# EAGLE board v2 (EAGLE 9.6.2), part 1 of 2
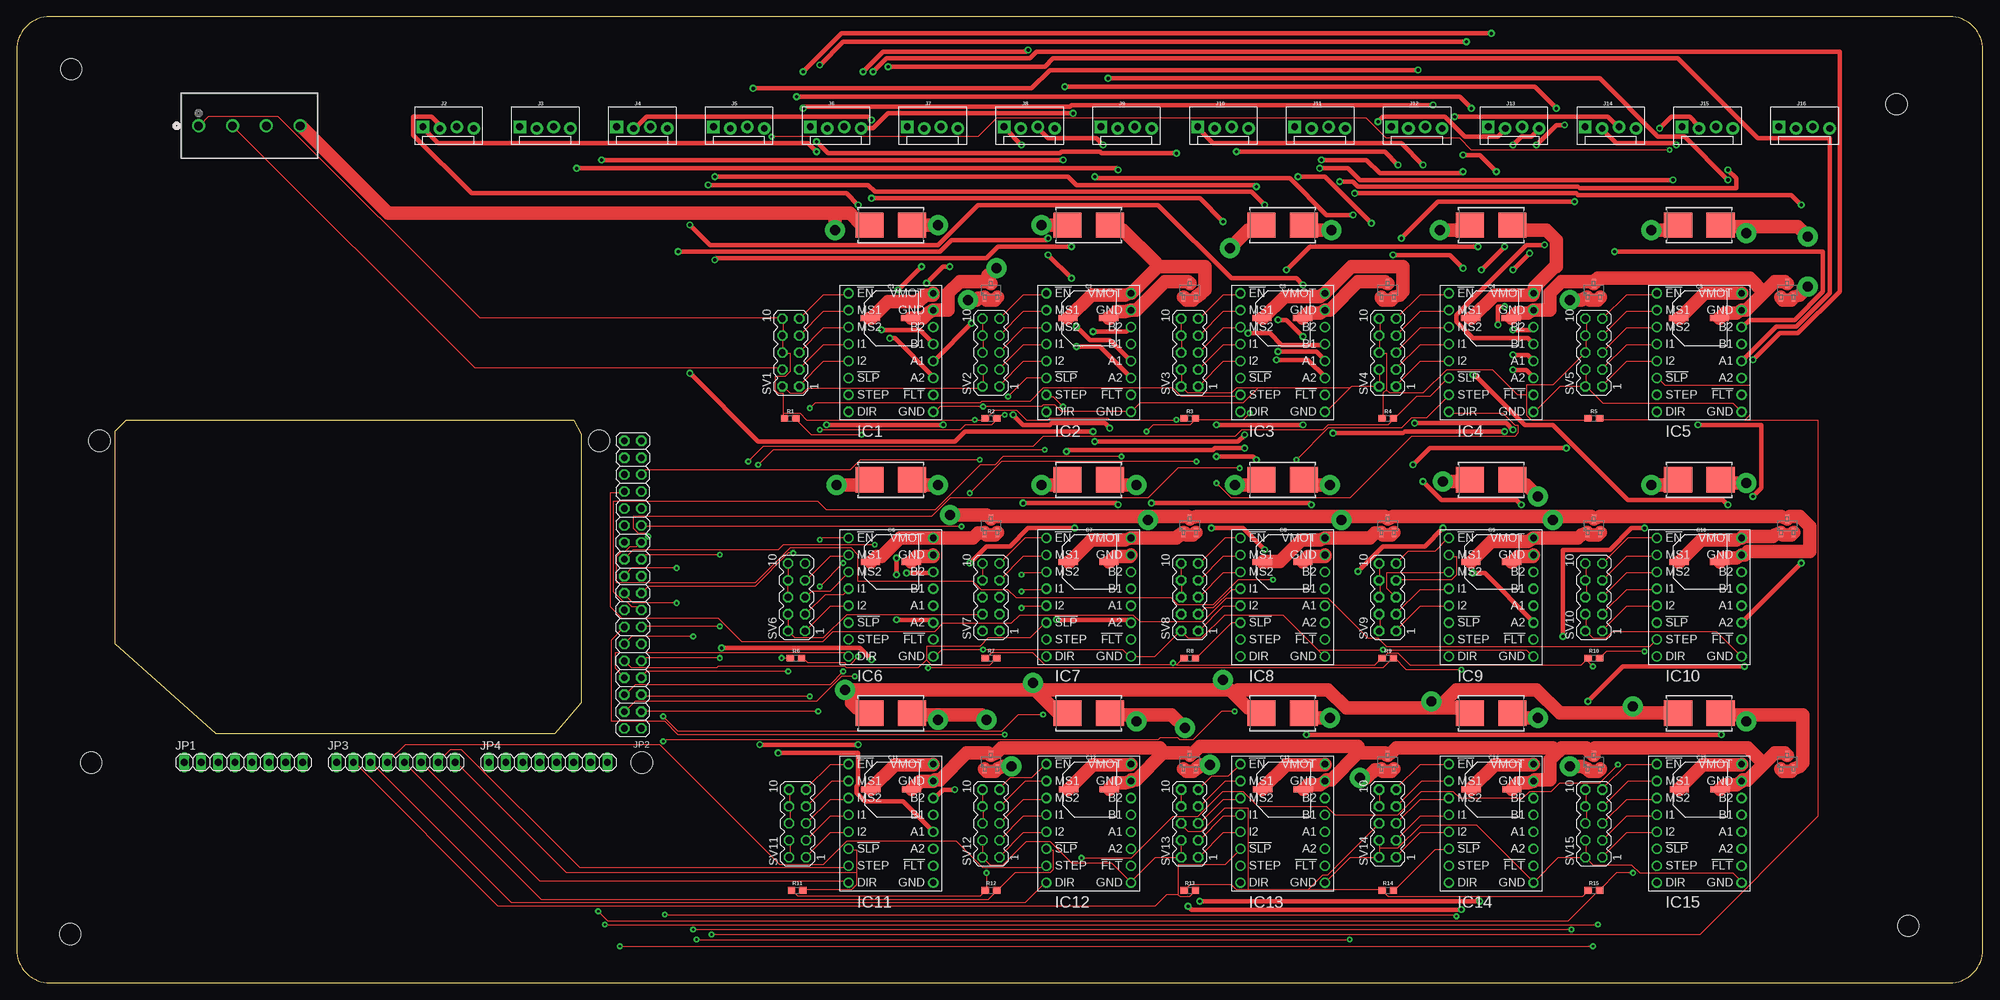
[diagram p5: board, top side]
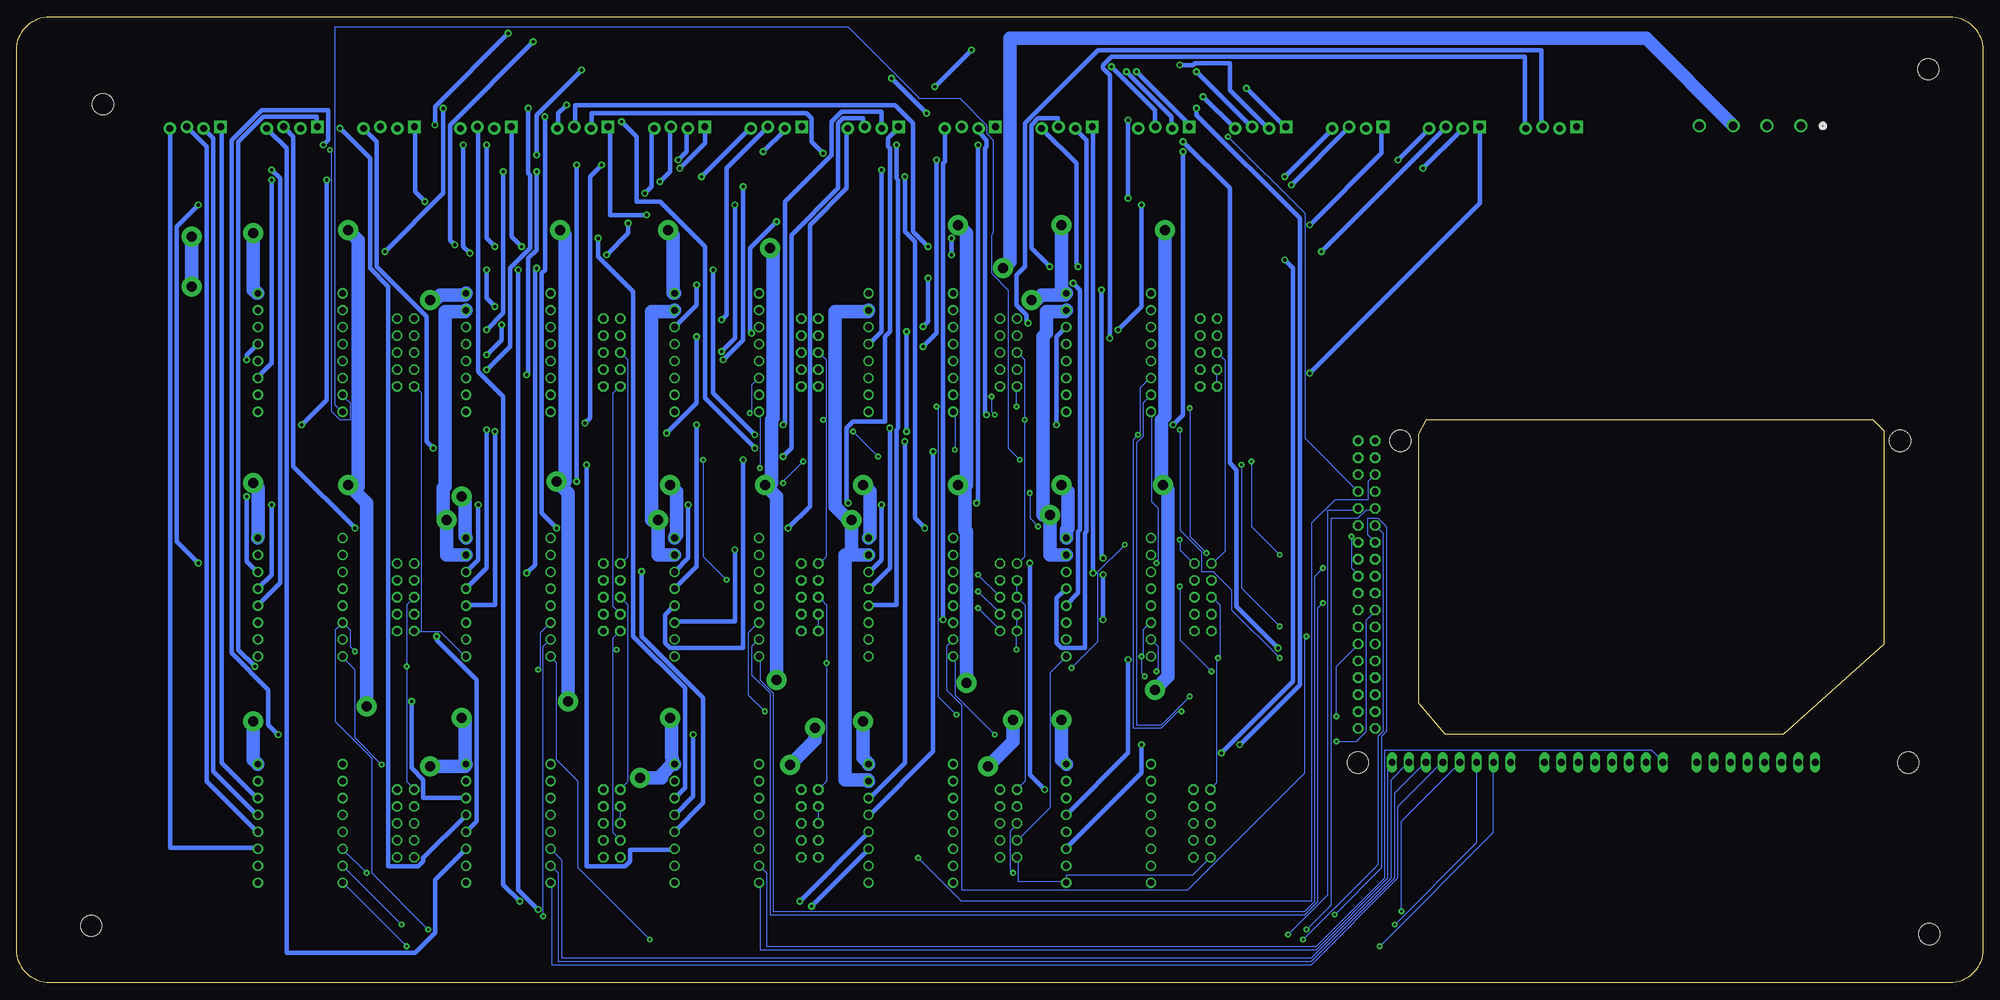
[diagram p6: board, bottom side, seen from below]

Size 295 x 145 mm. Coordinates in mm from the lower left corner, seen from the top.
Outline: 0,140 0,5 arc90 5,0 290,0 arc90 295,5 295,140 arc90 290,145 5,145 arc90 0,140
Outline: 14.8,82.8 16.45,84.45 83.55,84.45 84.7,82.4 84.7,42.05 80.7,37.4 29.9,37.4 14.8,50.9 14.8,82.8
Copper layers (1*16): Top 0.035mm / dielectric 1.5mm / Bottom 0.035mm
Design rules "default *": minimum track width 6mil, minimum drill 0.35mm, track to track 6mil, track to pad 6mil, pad to pad 6mil, via to via 6mil, smd to smd 6mil, copper to edge 40mil, drill to drill 6mil, minimum pad ring 10mil, minimum via ring 10mil, stop-mask expansion 4mil, vias tented up to drill 0mil, thermal gap 10mil
Net classes: 1 Motor: width 0.699 mm, drill 0.5 mm; 2 VMOT: width 0.699 mm, drill 0.5 mm; 3 GND: width 0.699 mm, drill 0.5 mm; 4 PreFuse: width 2.032 mm, drill 1.5 mm, clearance 0.006 mm
Holes 3.2 mm at 8.05,7.32 12.43,81.35 11.16,33.05 87.39,81.35 93.79,33.05 8.2,137.12 283.8,8.57 282.05,131.87

## Footprints (pad centres in the part's own frame; a part is rotated, then mirrored left to right if it is on the bottom)
8X10.5 = smd 2.9 x 0.9: + -3.05,0; - 3.05,0
SOT-23_DBZ_TEX = smd 0.568 x 1.31: 1 -0.95,-1.016; 2 0.95,-1.016; 3 0,1.016
0154SERIES_LTF = smd 4.242 x 3.81: 1 -3.188,0; 2 3.188,0
MP6500 = drill 1.016: 1 -6.35,8.89; 2 -6.35,6.35; 3 -6.35,3.81; 4 -6.35,1.27; 5 -6.35,-1.27; 6 -6.35,-3.81; 7 -6.35,-6.35; 8 -6.35,-8.89; 9 6.35,-8.89; 10 6.35,-6.35; 11 6.35,-3.81; 12 6.35,-1.27; 13 6.35,1.27; 14 6.35,3.81; 15 6.35,6.35; 16 6.35,8.89
CONN_1888700_PXC = drill 1.295 pad 1.803: 1 0,0; 2 5.08,0; 3 10.16,0; 4 15.24,0
MOLEX-1X4_LOCK = drill 1.016 pad 1.88 square: 1 0,0.127 | drill 1.016 pad 1.88: 2 2.54,-0.127; 3 5.08,0.127; 4 7.62,-0.127
1X08 = drill 1.016 long: 1 -8.89,0; 2 -6.35,0; 3 -3.81,0; 4 -1.27,0; 5 1.27,0; 6 3.81,0; 7 6.35,0; 8 8.89,0
2X18 = drill 1.016 octagon: 1 -21.59,-1.27; 2 -21.59,1.27; 3 -19.05,-1.27; 4 -19.05,1.27; 5 -16.51,-1.27; 6 -16.51,1.27; 7 -13.97,-1.27; 8 -13.97,1.27; 9 -11.43,-1.27; 10 -11.43,1.27; 11 -8.89,-1.27; 12 -8.89,1.27; 13 -6.35,-1.27; 14 -6.35,1.27; 15 -3.81,-1.27; 16 -3.81,1.27; 17 -1.27,-1.27; 18 -1.27,1.27; 19 1.27,-1.27; 20 1.27,1.27; 21 3.81,-1.27; 22 3.81,1.27; 23 6.35,-1.27; 24 6.35,1.27; 25 8.89,-1.27; 26 8.89,1.27; 27 11.43,-1.27; 28 11.43,1.27; 29 13.97,-1.27; 30 13.97,1.27; 31 16.51,-1.27; 32 16.51,1.27; 33 19.05,-1.27; 34 19.05,1.27; 35 21.59,-1.27; 36 21.59,1.27
0603 = smd 1.1 x 1: 1 -0.85,0; 2 0.85,0
MA05-2 = drill 1.016 octagon: 1 -5.08,-1.27; 2 -5.08,1.27; 3 -2.54,-1.27; 4 -2.54,1.27; 5 0,-1.27; 6 0,1.27; 7 2.54,-1.27; 8 2.54,1.27; 9 5.08,-1.27; 10 5.08,1.27

## Placement (x,y rotation side)
C1  100uF  [8X10.5]  131.12,99.74 0 top
C2  100uF  [8X10.5]  160.79,99.74 0 top
C3  100uF  [8X10.5]  189.89,99.74 0 top
C4  100uF  [8X10.5]  221.19,99.74 0 top
C5  100uF  [8X10.5]  252.4,99.74 0 top
C6  100uF  [8X10.5]  131.16,63.17 0 top
C7  100uF  [8X10.5]  160.84,63.17 0 top
C8  100uF  [8X10.5]  189.94,63.17 0 top
C9  100uF  [8X10.5]  221.24,63.17 0 top
C10  100uF  [8X10.5]  252.45,63.17 0 top
C11  100uF  [8X10.5]  131.22,29.02 0 top
C12  100uF  [8X10.5]  160.89,29.02 0 top
C13  100uF  [8X10.5]  189.99,29.02 0 top
C14  100uF  [8X10.5]  221.29,29.02 0 top
C15  100uF  [8X10.5]  252.5,29.02 0 top
CR1  PESD2CAN24DBZRQ1  [SOT-23_DBZ_TEX]  146.18,103.92 0 top
CR2  PESD2CAN24DBZRQ1  [SOT-23_DBZ_TEX]  176,103.92 0 top
CR3  PESD2CAN24DBZRQ1  [SOT-23_DBZ_TEX]  205.7,103.92 0 top
CR4  PESD2CAN24DBZRQ1  [SOT-23_DBZ_TEX]  236.62,103.92 0 top
CR5  PESD2CAN24DBZRQ1  [SOT-23_DBZ_TEX]  265.65,103.92 0 top
CR6  PESD2CAN24DBZRQ1  [SOT-23_DBZ_TEX]  146.18,68.6 0 top
CR7  PESD2CAN24DBZRQ1  [SOT-23_DBZ_TEX]  176,68.6 0 top
CR8  PESD2CAN24DBZRQ1  [SOT-23_DBZ_TEX]  205.7,68.6 0 top
CR9  PESD2CAN24DBZRQ1  [SOT-23_DBZ_TEX]  236.62,68.6 0 top
CR10  PESD2CAN24DBZRQ1  [SOT-23_DBZ_TEX]  265.65,68.6 0 top
CR11  PESD2CAN24DBZRQ1  [SOT-23_DBZ_TEX]  146.18,33.12 0 top
CR12  PESD2CAN24DBZRQ1  [SOT-23_DBZ_TEX]  176,33.12 0 top
CR13  PESD2CAN24DBZRQ1  [SOT-23_DBZ_TEX]  205.7,33.12 0 top
CR14  PESD2CAN24DBZRQ1  [SOT-23_DBZ_TEX]  236.62,33.12 0 top
CR15  PESD2CAN24DBZRQ1  [SOT-23_DBZ_TEX]  265.65,33.12 0 top
F1  [0154SERIES_LTF]  131.16,113.71 0 top
F2  [0154SERIES_LTF]  160.84,113.71 0 top
F3  [0154SERIES_LTF]  189.94,113.71 0 top
F4  [0154SERIES_LTF]  221.24,113.71 0 top
F5  [0154SERIES_LTF]  252.45,113.71 0 top
F6  [0154SERIES_LTF]  131.16,75.47 0 top
F7  [0154SERIES_LTF]  160.84,75.47 0 top
F8  [0154SERIES_LTF]  189.94,75.47 0 top
F9  [0154SERIES_LTF]  221.24,75.47 0 top
F10  [0154SERIES_LTF]  252.45,75.47 0 top
F11  [0154SERIES_LTF]  131.16,40.45 0 top
F12  [0154SERIES_LTF]  160.84,40.45 0 top
F13  [0154SERIES_LTF]  189.94,40.45 0 top
F14  [0154SERIES_LTF]  221.24,40.45 0 top
F15  [0154SERIES_LTF]  252.45,40.45 0 top
IC1  2969-MP6500  [MP6500]  131.16,94.59 0 top
IC2  2969-MP6500  [MP6500]  160.84,94.59 0 top
IC3  2969-MP6500  [MP6500]  189.94,94.59 0 top
IC4  2969-MP6500  [MP6500]  221.24,94.59 0 top
IC5  2969-MP6500  [MP6500]  252.45,94.59 0 top
IC6  2969-MP6500  [MP6500]  131.16,57.87 0 top
IC7  2969-MP6500  [MP6500]  160.84,57.87 0 top
IC8  2969-MP6500  [MP6500]  189.94,57.87 0 top
IC9  2969-MP6500  [MP6500]  221.24,57.87 0 top
IC10  2969-MP6500  [MP6500]  252.45,57.87 0 top
IC11  2969-MP6500  [MP6500]  131.16,23.93 0 top
IC12  2969-MP6500  [MP6500]  160.84,23.93 0 top
IC13  2969-MP6500  [MP6500]  189.94,23.93 0 top
IC14  2969-MP6500  [MP6500]  221.24,23.93 0 top
IC15  2969-MP6500  [MP6500]  252.45,23.93 0 top
J1  1888700  [CONN_1888700_PXC]  27.3,128.61 0 top
J2  [MOLEX-1X4_LOCK]  60.95,128.36 0 top
J3  [MOLEX-1X4_LOCK]  75.48,128.36 0 top
J4  [MOLEX-1X4_LOCK]  90.01,128.36 0 top
J5  [MOLEX-1X4_LOCK]  104.55,128.36 0 top
J6  [MOLEX-1X4_LOCK]  119.08,128.36 0 top
J7  [MOLEX-1X4_LOCK]  133.61,128.36 0 top
J8  [MOLEX-1X4_LOCK]  148.14,128.36 0 top
J9  [MOLEX-1X4_LOCK]  162.67,128.36 0 top
J10  [MOLEX-1X4_LOCK]  177.21,128.36 0 top
J11  [MOLEX-1X4_LOCK]  191.74,128.36 0 top
J12  [MOLEX-1X4_LOCK]  206.27,128.36 0 top
J13  [MOLEX-1X4_LOCK]  220.8,128.36 0 top
J14  [MOLEX-1X4_LOCK]  235.34,128.36 0 top
J15  [MOLEX-1X4_LOCK]  249.87,128.36 0 top
J16  [MOLEX-1X4_LOCK]  264.4,128.36 0 top
JP1  [1X08]  34.03,33.09 0 top
JP2  [2X18]  92.45,59.76 90 top
JP3  [1X08]  56.89,33.09 0 top
JP4  [1X08]  79.75,33.09 0 top
R1  2.0k  [0603]  116.06,84.7 0 top
R2  2.0k  [0603]  146.18,84.7 0 top
R3  2.0k  [0603]  176,84.7 0 top
R4  2.0k  [0603]  205.7,84.7 0 top
R5  2.0k  [0603]  236.62,84.7 0 top
R6  2.0k  [0603]  116.91,48.75 0 top
R7  2.0k  [0603]  146.18,48.75 0 top
R8  2.0k  [0603]  176,48.75 0 top
R9  2.0k  [0603]  205.7,48.75 0 top
R10  2.0k  [0603]  236.62,48.75 0 top
R11  2.0k  [0603]  117.11,13.89 0 top
R12  2.0k  [0603]  146.18,13.89 0 top
R13  2.0k  [0603]  176,13.89 0 top
R14  2.0k  [0603]  205.7,13.89 0 top
R15  2.0k  [0603]  236.62,13.89 0 top
SV1  [MA05-2]  116.16,94.59 90 top
SV2  [MA05-2]  146.18,94.59 90 top
SV3  [MA05-2]  176,94.59 90 top
SV4  [MA05-2]  205.7,94.59 90 top
SV5  [MA05-2]  236.62,94.59 90 top
SV6  [MA05-2]  117.01,57.87 90 top
SV7  [MA05-2]  146.18,57.87 90 top
SV8  [MA05-2]  176,57.87 90 top
SV9  [MA05-2]  205.7,57.87 90 top
SV10  [MA05-2]  236.62,57.87 90 top
SV11  [MA05-2]  117.16,23.93 90 top
SV12  [MA05-2]  146.18,23.93 90 top
SV13  [MA05-2]  176,23.93 90 top
SV14  [MA05-2]  205.7,23.93 90 top
SV15  [MA05-2]  236.62,23.93 90 top